# EAGLE design beer_machine_HAT (EAGLE 6.6.0)
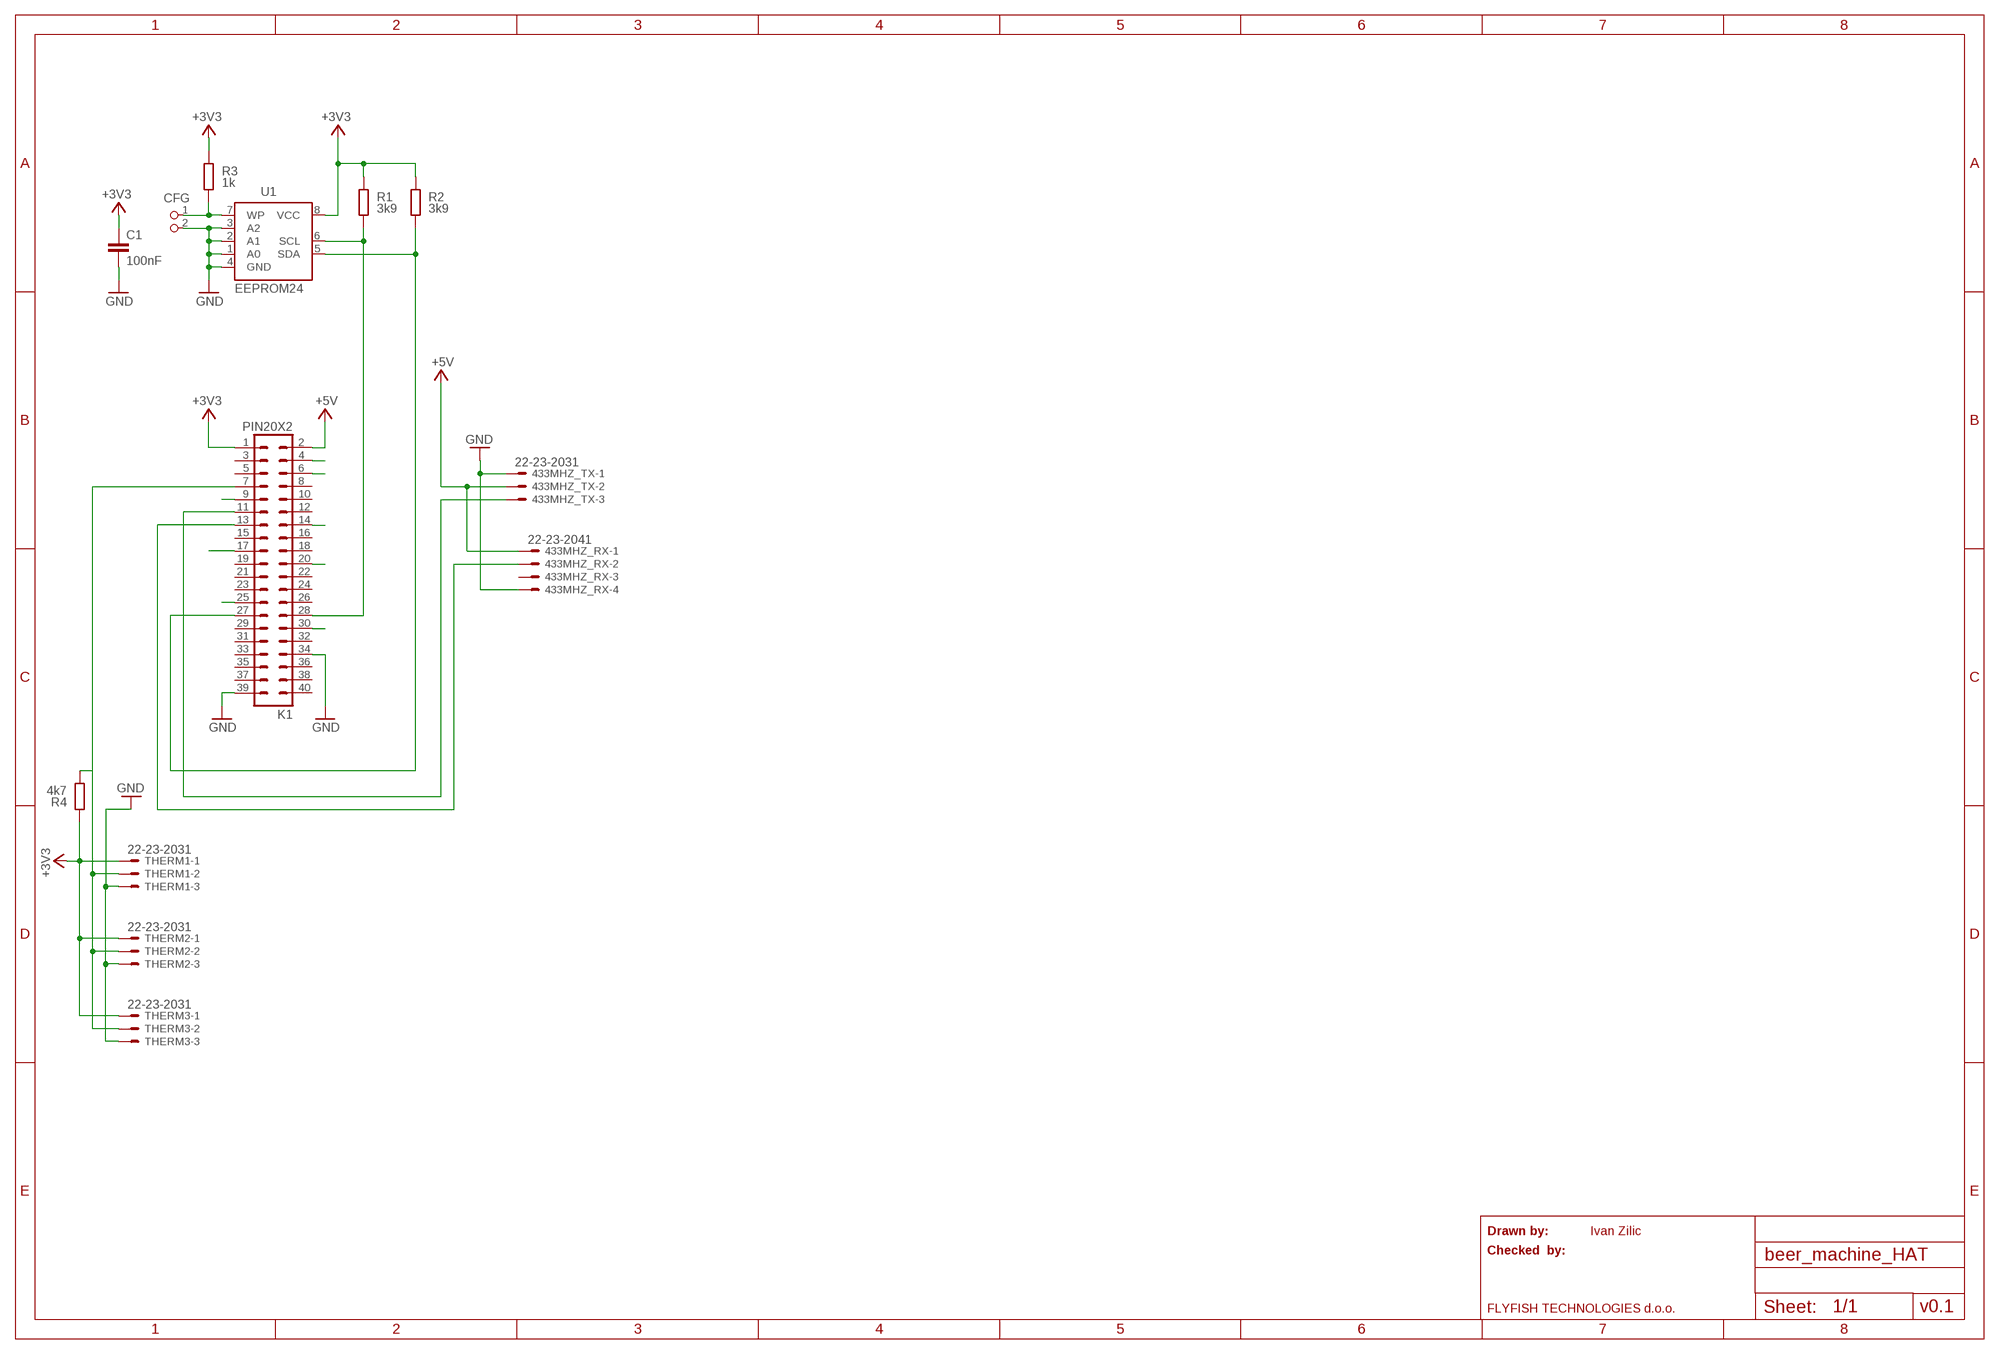
[diagram p0: schematic, sheet 1]

## Parts
433MHZ_RX  22-23-2041  [22-23-2041]
433MHZ_TX  22-23-2031  [22-23-2031]
C1  100nF  C-EUC0805K  [C0805K]
CFG  PIN2_100  [PIN_W_2]
K1  PIN20X2  [PIN_20X2]
R1  3k9  R-EU_M0805  [M0805]
R2  3k9  R-EU_M0805  [M0805]
R3  1k  R-EU_M0805  [M0805]
R4  4k7  R-EU_M0805  [M0805]
THERM1  22-23-2031  [22-23-2031]
THERM2  22-23-2031  [22-23-2031]
THERM3  22-23-2031  [22-23-2031]
U1  EEPROM24  [SOIC8]

## Nets
+3V3: C1.1 K1.1 R1.2 R2.2 R3.2 R4.2 THERM1.1 THERM2.1 THERM3.1 U1.8(VCC)
+5V: 433MHZ_RX.1 433MHZ_TX.2 K1.2
GND: 433MHZ_RX.4 433MHZ_TX.1 C1.2 CFG.2 K1.34 K1.39 THERM1.3 THERM2.3 THERM3.3 U1.1(A0) U1.2(A1) U1.3(A2) U1.4(GND)
N$1: K1.28 R1.1 U1.6(SCL)
N$2: K1.27 R2.1 U1.5(SDA)
N$3: CFG.1 R3.1 U1.7(WP)
N$4: K1.7 R4.1 THERM1.2 THERM2.2 THERM3.2
N$5: 433MHZ_TX.3 K1.11
N$6: 433MHZ_RX.2 K1.13
N$7: K1.4
N$8: K1.6
N$9: K1.14
N$10: K1.20
N$11: K1.30
N$12: K1.17
N$13: K1.9
N$14: K1.25
Unconnected: 433MHZ_RX.3 K1.3 K1.5 K1.8 K1.10 K1.12 K1.15 K1.16 K1.18 K1.19 K1.21 K1.22 K1.23 K1.24 K1.26 K1.29 K1.31 K1.32 K1.33 K1.35 K1.36 K1.37 K1.38 K1.40

## Notes on the sheet
- Drawn by: | Ivan Zilic
- Checked  by:
- FLYFISH TECHNOLOGIES d.o.o. | v0.1

## Library data of the parts
433MHZ_RX = con-molex:22-23-2041: .100" (2.54mm) Center Header - 4 Pin; MF: MOLEX; MPN: 22-23-2041; OC_FARNELL: 1462920; OC_NEWARK: 38C0355
433MHZ_TX THERM1-THERM3 = con-molex:22-23-2031: .100" (2.54mm) Center Header - 3 Pin; MF: MOLEX; MPN: 22-23-2031; OC_FARNELL: 1462950; OC_NEWARK: 30C0862
C1 = resistor:C-EU: CAPACITOR, European symbol; DIELECTRIC: X7R
CFG = FLYFISH:PIN2
K1 = FLYFISH:PIN20X2
R1-R4 = resistor:R-EU_: RESISTOR, European symbol; TOLERANCE: 5%
U1 = FLYFISH:EEPROM24

## Board
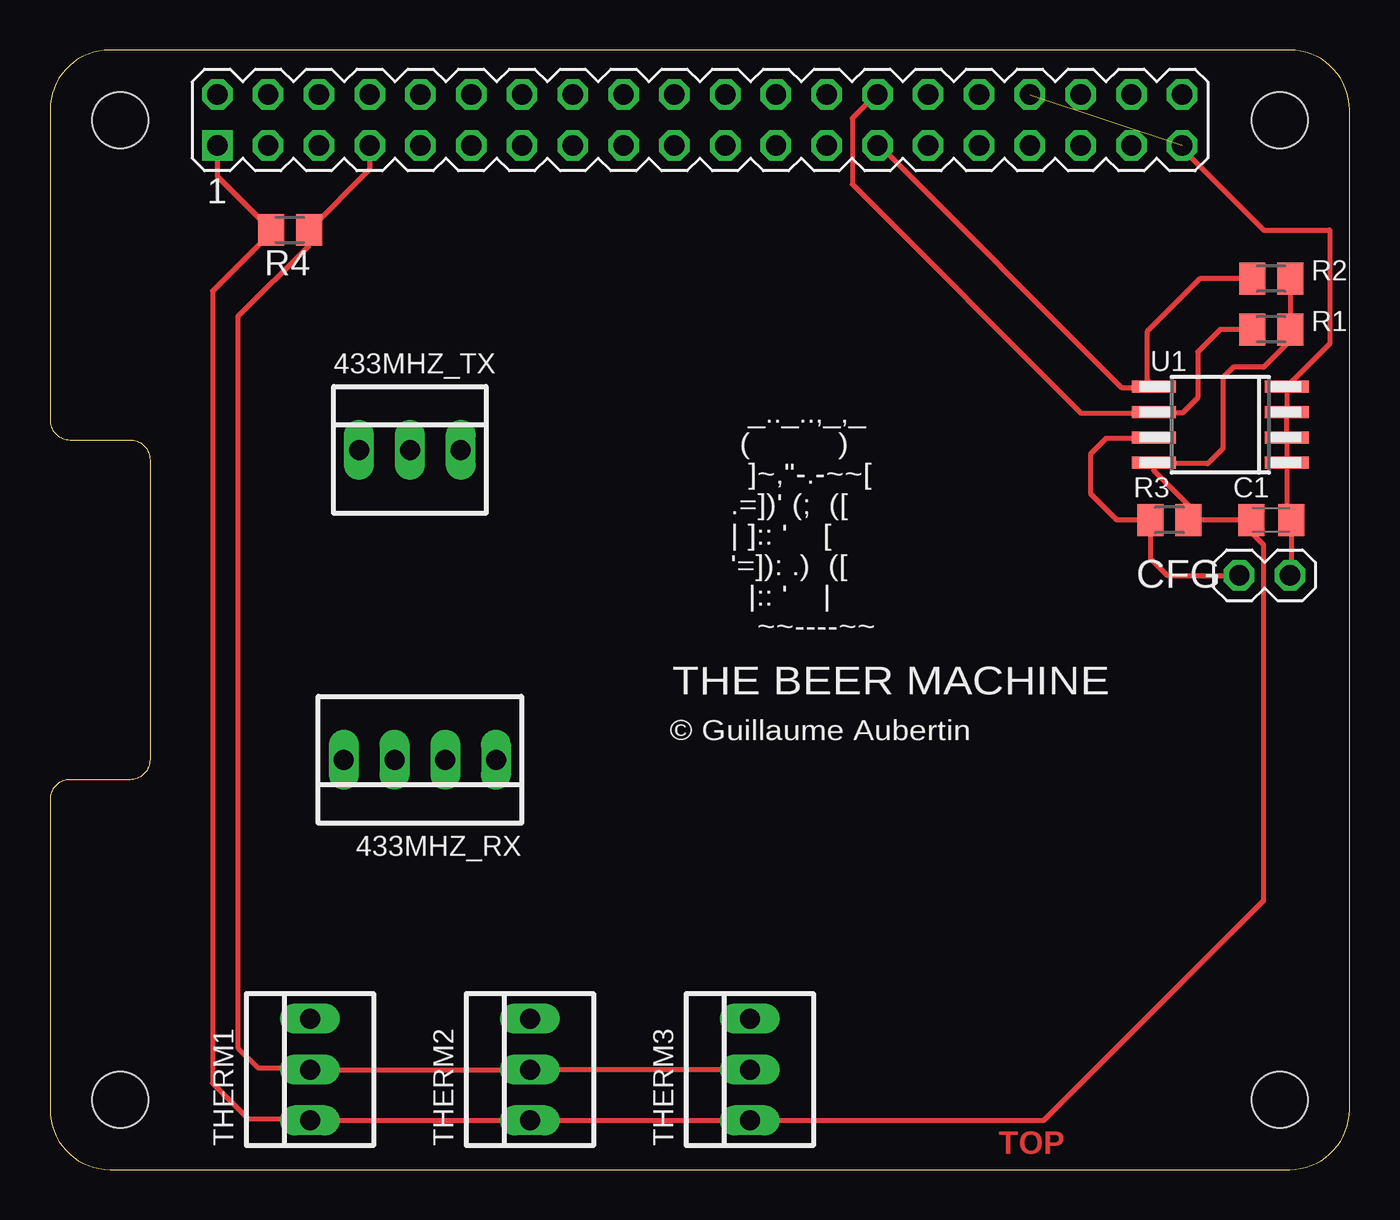
[diagram p1: board, top side]
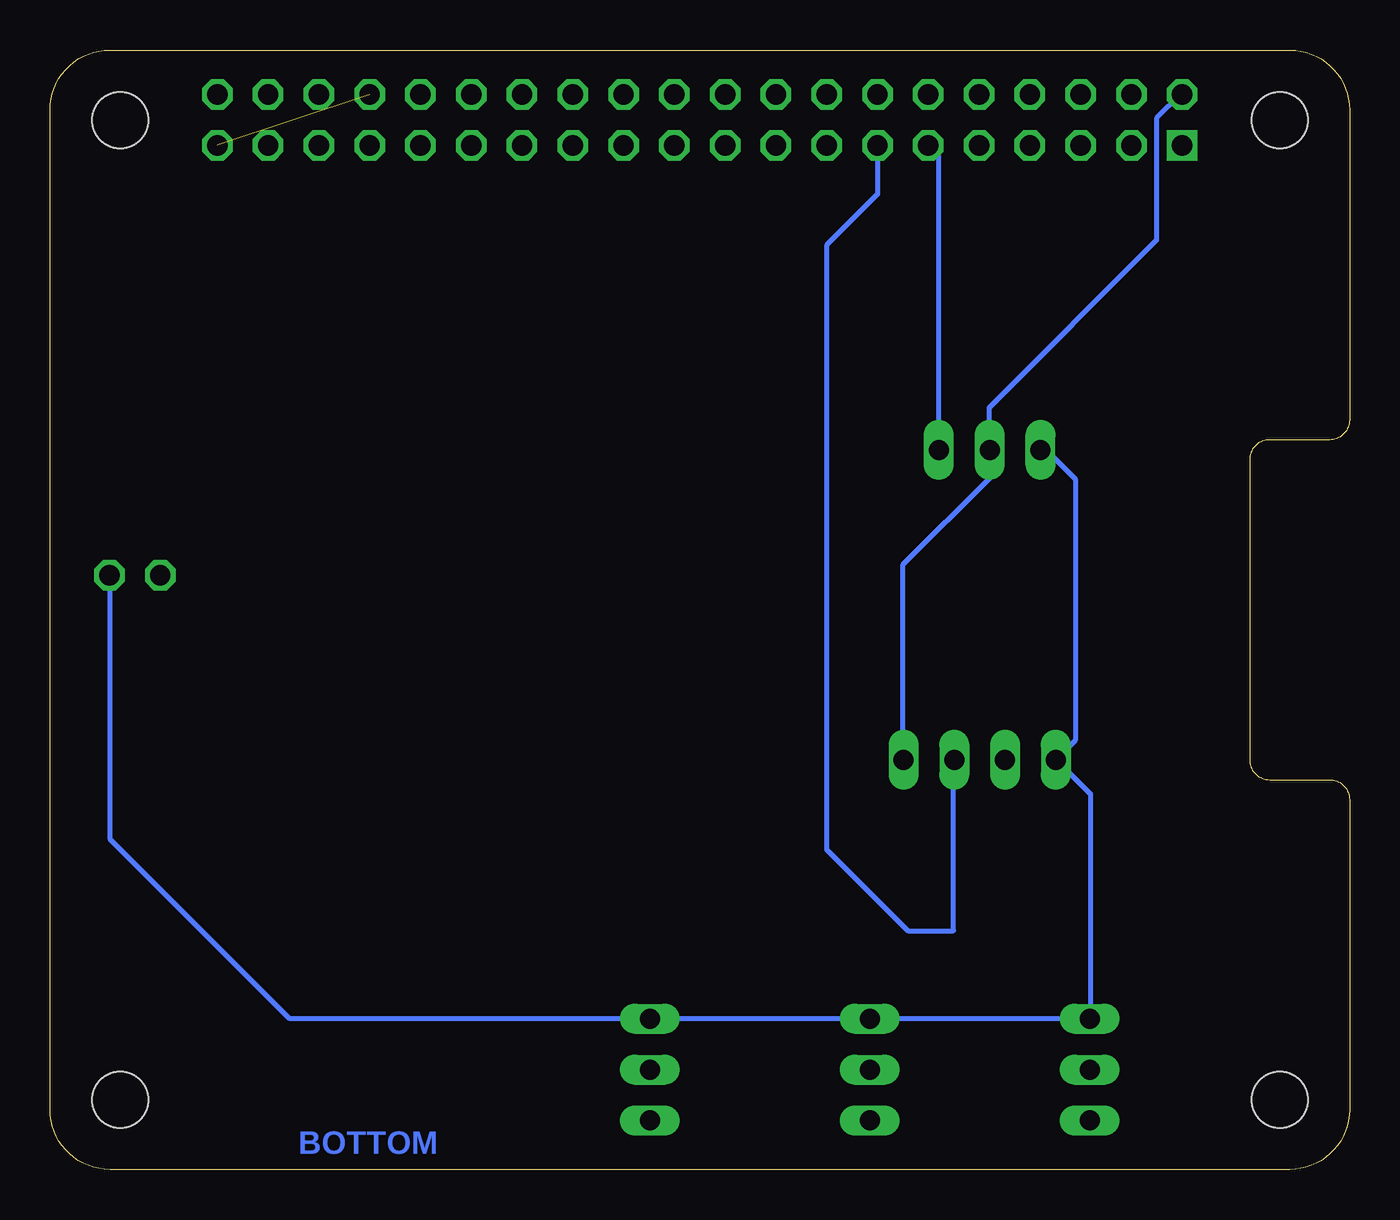
[diagram p2: board, bottom side, seen from below]

Size 65 x 56 mm. Coordinates in mm from the lower left corner, seen from the top.
Outline: 0,3 arc90 3,0 62,0 arc90 65,3 65,53 arc90 62,56 3,56 arc90 0,53 0,37.5 arc90 1,36.5 4,36.5 arc-90 5,35.5 5,20.5 arc-90 4,19.5 1,19.5 arc90 0,18.5 0,3
Copper layers (1*16): Top 0.035mm / dielectric 1.5mm / Bottom 0.035mm
Design rules "ITEADstudio_DRC": minimum track width 6mil, minimum drill 12mil, track to track 6mil, track to pad 6mil, pad to pad 6mil, via to via 6mil, smd to smd 0mil, copper to edge 10mil, drill to drill 10mil, minimum pad ring 10mil, minimum via ring 6mil, stop-mask expansion 2mil, vias tented up to drill 100mil, thermal gap 10mil
Holes 2.8 mm at 3.5,3.5 3.5,52.5 61.5,52.5 61.5,3.5
tRestrict: area 1.9,51 to 5,54; area 60,51 to 63,54; area 60,1.9 to 63,5; area 1.9,1.9 to 5,5
bRestrict: area 1.9,1.9 to 5,5; area 1.9,51 to 5,54; area 60,1.9 to 63,5; area 60,51 to 63,54

### Footprints (pad centres in the part's own frame; a part is rotated, then mirrored left to right if it is on the bottom)
22-23-2041 = drill 1 long: 1 -3.81,0; 2 -1.27,0; 3 1.27,0; 4 3.81,0
22-23-2031 = drill 1 long: 1 -2.54,0; 2 0,0; 3 2.54,0
C0805K = smd 1.3 x 1.6: 1 -1,0; 2 1,0
PIN_W_2 = drill 1.016 octagon: 1 0,0; 2 0,-2.54
PIN_20X2 = drill 1.016 square: 1 -24.13,-1.27 | drill 1.016 octagon: 2 -24.13,1.27; 3 -21.59,-1.27; 4 -21.59,1.27; 5 -19.05,-1.27; 6 -19.05,1.27; 7 -16.51,-1.27; 8 -16.51,1.27; 9 -13.97,-1.27; 10 -13.97,1.27; 11 -11.43,-1.27; 12 -11.43,1.27; 13 -8.89,-1.27; 14 -8.89,1.27; 15 -6.35,-1.27; 16 -6.35,1.27; 17 -3.81,-1.27; 18 -3.81,1.27; 19 -1.27,-1.27; 20 -1.27,1.27; 21 1.27,-1.27; 22 1.27,1.27; 23 3.81,-1.27; 24 3.81,1.27; 25 6.35,-1.27; 26 6.35,1.27; 27 8.89,-1.27; 28 8.89,1.27; 29 11.43,-1.27; 30 11.43,1.27; 31 13.97,-1.27; 32 13.97,1.27; 33 16.51,-1.27; 34 16.51,1.27; 35 19.05,-1.27; 36 19.05,1.27; 37 21.59,-1.27; 38 21.59,1.27; 39 24.13,-1.27; 40 24.13,1.27
M0805 = smd 1.3 x 1.6: 1 -0.95,0; 2 0.95,0
SOIC8 = smd 0.6 x 2.2: 1 -1.905,-3.33; 2 -0.635,-3.33; 3 0.635,-3.33; 4 1.905,-3.33; 5 1.905,3.33; 6 0.635,3.33; 7 -0.635,3.33; 8 -1.905,3.33

### Placement (x,y rotation side)
433MHZ_RX  18.5,20.5 180 top
433MHZ_TX  18,36 0 top
C1  61.08,32.5 0 top
CFG  59.48,29.73 90 top
K1  32.5,52.5 0 top
R1  61.08,42.02 0 top
R2  61.08,44.56 0 top
R3  55.99,32.5 0 top
R4  12,47 180 top
THERM1  13,5 90 top
THERM2  24,5 90 top
THERM3  35,5 90 top
U1  58.53,37.26 90 top

### Tracks (layer width: path | path; a pad name or v marks a point on that pad's centre or on a via)
+3V3
  Top 0.254: K1.1 8.37,49.68 R4.2 11.05,46.86 8.13,43.94 8.13,4.32 9.91,2.54 12.92,2.54 THERM1.1 THERM2.1 THERM3.1 49.7,2.46 60.71,13.46 60.71,31.24 59.94,32 59.94,32.37 C1.1 R3.2 57.15,32.7 57.15,33.02 55.2,34.97 U1.8 55.25,35.31 57.91,35.31 58.67,36.07 58.67,39.62 59.18,40.13 60.71,40.13 62.02,41.45 R1.2 R2.2
+5V
  Bottom 0.254: K1.2 8.46,53.77 9.65,52.58 9.65,46.48 18.03,38.1 18.03,36.03 433MHZ_TX.2 18,34.58 22.35,30.23 22.35,20.54 433MHZ_RX.1
GND  (1 unrouted)
  Top 0.254: K1.39 56.63,51.07 60.71,46.99 64.01,46.99 64.01,41.31 U1.4 U1.3 U1.2 U1.1 61.87,32.71 C1.2 62.08,29.78 CFG.2
  Bottom 0.254: 433MHZ_TX.1 15.17,36 13.72,34.54 13.72,21.47 433MHZ_RX.4 14.66,20.5 12.95,18.8 12.95,7.59 THERM1.3 THERM2.3 THERM3.3 53.01,7.54 61.98,16.51 61.98,29.68 CFG.2
N$1
  Top 0.254: K1.28 41.32,53.77 40.13,52.58 40.13,49.28 51.56,37.85 55.16,37.85 U1.6 55.25,37.85 56.64,37.85 57.4,38.61 57.4,40.89 58.53,42.02 R1.1
N$2
  Top 0.254: K1.27 41.48,51.23 53.59,39.12 55.16,39.12 U1.5 54.86,39.51 54.86,41.91 57.52,44.56 R2.1
N$3
  Top 0.254: U1.7 55.16,36.58 52.83,36.58 52.07,35.81 52.07,33.78 53.35,32.5 R3.1 55.05,30.55 55.88,29.72 59.47,29.72 CFG.1
N$4
  Top 0.254: R4.1 15.99,50.04 K1.7 | R4.1 | R4.1 12.95,46.22 9.4,42.67 9.4,6.1 10.41,5.08 12.92,5.08 THERM1.2 THERM2.2 THERM3.2
N$5
  Bottom 0.254: 433MHZ_TX.3 20.54,50.7 K1.11
N$6
  Bottom 0.254: K1.13 23.61,48.78 26.16,46.23 26.16,16 22.1,11.94 19.81,11.94 19.81,20.46 433MHZ_RX.2

### Text on the board
Top: TOP
Bottom: BOTTOM
tPlace: _.._..,_,_ / ( ) / ]~,"-.-~~[ / .=])' (; ([ / | ]:: ' [ / '=]): .) ([ / |:: ' | / ~~----~~ | THE BEER MACHINE | © Guillaume Aubertin